# Altium schematic sheet switch_vn9e30f.SchDoc
size A
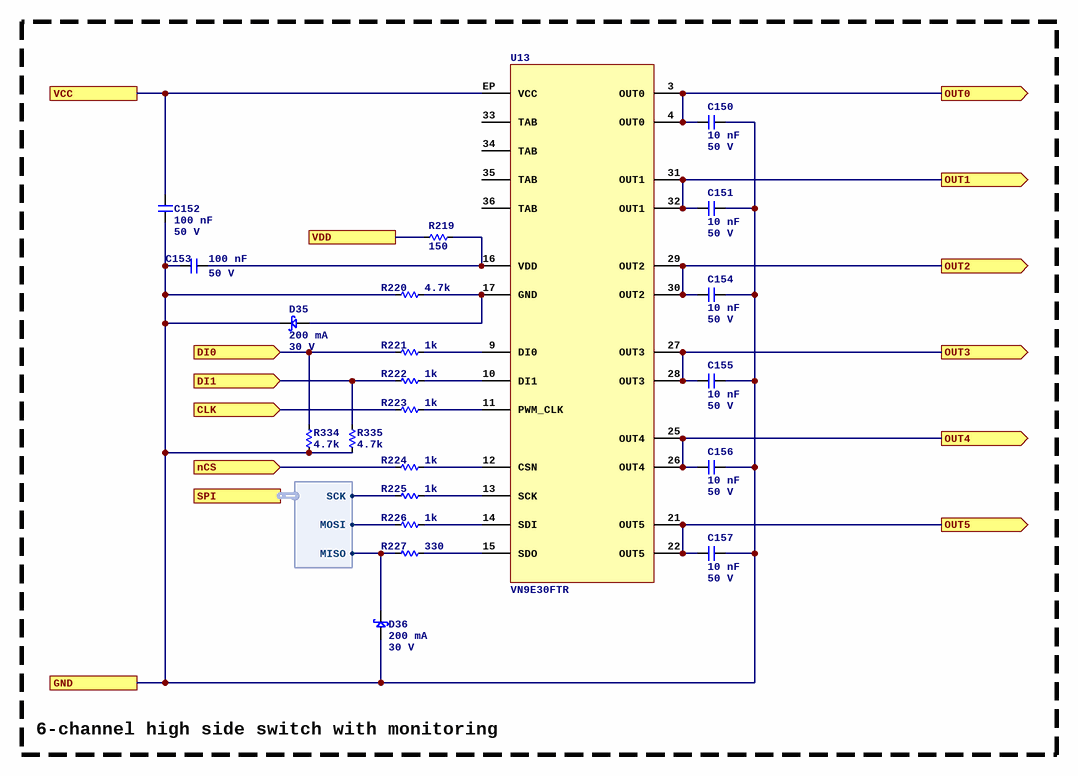
[diagram p0: switch_vn9e30f.SchDoc]

## Parts
C150  Capacitance: 10 nF  Voltage Rating: 50 V  [C0402]  (hidden comment: CL05B103KB5NNNC)
C151  Capacitance: 10 nF  Voltage Rating: 50 V  [C0402]  (hidden comment: CL05B103KB5NNNC)
C152  Capacitance: 100 nF  Voltage Rating: 50 V  [C0402]  (hidden comment: CL05B104KB54PNC)
C153  Capacitance: 100 nF  Voltage Rating: 50 V  [C0402]  (hidden comment: CL05B104KB54PNC)
C154  Capacitance: 10 nF  Voltage Rating: 50 V  [C0402]  (hidden comment: CL05B103KB5NNNC)
C155  Capacitance: 10 nF  Voltage Rating: 50 V  [C0402]  (hidden comment: CL05B103KB5NNNC)
C156  Capacitance: 10 nF  Voltage Rating: 50 V  [C0402]  (hidden comment: CL05B103KB5NNNC)
C157  Capacitance: 10 nF  Voltage Rating: 50 V  [C0402]  (hidden comment: CL05B103KB5NNNC)
D35  Current: 200 mA  Vr: 30 V  [SOD523]  (hidden comment: BAT54XV2T1G)
D36  Current: 200 mA  Vr: 30 V  [SOD523]  (hidden comment: BAT54XV2T1G)
R219  value 150  [R0402]  (hidden comment: 0402WGF1500TCE)
R220  value 4.7k  [R0402]  (hidden comment: 0402WGF4701TCE)
R221  value 1k  [R0402]  (hidden comment: 0402WGF1001TCE)
R222  value 1k  [R0402]  (hidden comment: 0402WGF1001TCE)
R223  value 1k  [R0402]  (hidden comment: 0402WGF1001TCE)
R224  value 1k  [R0402]  (hidden comment: 0402WGF1001TCE)
R225  value 1k  [R0402]  (hidden comment: 0402WGF1001TCE)
R226  value 1k  [R0402]  (hidden comment: 0402WGF1001TCE)
R227  value 330  [R0402]  (hidden comment: 0402WGF3300TCE)
R334  value 4.7k  [R0402]  (hidden comment: 0402WGF4701TCE)
R335  value 4.7k  [R0402]  (hidden comment: 0402WGF4701TCE)
U13  VN9E30FTR  [ST_ECOPACK_QFN50P600X600X90-32N]

## Blocks framed on the sheet
6-channel high side switch with monitoring: C150-C157 D35 D36 R219-R227 R334 R335 U13

## Ports
CLK (in), DI0 (in), DI1 (in), GND, nCS (in), OUT0 (out), OUT1 (out), OUT2 (out), OUT3 (out), OUT4 (out), OUT5 (out), SPI (harness SPI), VCC, VDD

## Harnesses
SPI: MISO, MOSI, SCK

## Nets
CLK: R223.2 ; port CLK
DI0: R221.2 R334.1 ; port DI0
DI1: R222.2 R335.1 ; port DI1
GND: C150.2 C151.2 C152.2 C153.2 C154.2 C155.2 C156.2 C157.2 D35.2 D36.1 R220.2 R334.2 R335.2 ; port GND
nCS: R224.2 ; port nCS
OUT0: C150.1 U13.3(OUT0) U13.4(OUT0) ; port OUT0
OUT1: C151.1 U13.31(OUT1) U13.32(OUT1) ; port OUT1
OUT2: C154.1 U13.29(OUT2) U13.30(OUT2) ; port OUT2
OUT3: C155.1 U13.27(OUT3) U13.28(OUT3) ; port OUT3
OUT4: C156.1 U13.25(OUT4) U13.26(OUT4) ; port OUT4
OUT5: C157.1 U13.21(OUT5) U13.22(OUT5) ; port OUT5
VCC: C152.1 U13.EP(VCC) ; port VCC
VDD: R219.1 ; port VDD
NetC153_1: C153.1 R219.2 U13.16(VDD)
NetD35_1: D35.1 R220.1 U13.17(GND)
NetD36_2: D36.2 R227.1 ; port SPI.MISO
NetR221_1: R221.1 U13.9(DI0)
NetR222_1: R222.1 U13.10(DI1)
NetR223_1: R223.1 U13.11(PWM_CLK)
NetR224_1: R224.1 U13.12(CSN)
NetR225_1: R225.1 U13.13(SCK)
NetR225_2: R225.2 ; port SPI.SCK
NetR226_1: R226.1 U13.14(SDI)
NetR226_2: R226.2 ; port SPI.MOSI
NetR227_2: R227.2 U13.15(SDO)

Not connected (* = marked no-connect by the designer): U13 33(TAB) 34(TAB) 35(TAB) 36(TAB)

## Library data of the parts
C150 C151 C154-C157 = CL05B103KB5NNNC: Manufacturer: Samsung Electro-Mechanics; Dielectric: X7R; ComponentLink1URL: https://wmsc.lcsc.com/wmsc/upload/file/pdf/v2/lcsc/2304140030_Samsung-Electro-Mechanics-CL05B103KB5NNNC_C15195.pdf; ComponentLink1Description: Datasheet; Manufacturer Part Number: CL05B103KB5NNNC; Package: 0402; Supplier 2: LCSC; Supplier Part Number 2: C15195
C152 C153 = CL05B104KB54PNC: Manufacturer: Samsung Electro-Mechanics; Dielectric: X7R; ComponentLink1URL: https://wmsc.lcsc.com/wmsc/upload/file/pdf/v2/lcsc/2304140030_Samsung-Electro-Mechanics-CL05B104KB54PNC_C307331.pdf; ComponentLink1Description: Datasheet; Manufacturer Part Number: CL05B104KB54PNC; Package: 0402; Supplier 2: LCSC; Supplier Part Number 2: C307331
D35 D36 = BAT54XV2T1G: ON Semi BAT54XV2T1G; SMT Schottky Diode; 30V 200mA; 5ns; 2-Pin SOD-523; Manufacturer: onsemi; Supplier 1: DigiKey; Supplier Part Number 1: BAT54XV2T1GOSCT-ND; Manufacturer Part Number: BAT54XV2T1G; Supplier 2: LCSC; Supplier Part Number 2: C81572; ComponentLink1Description: Datasheet; ComponentLink1URL: https://www.onsemi.com/pdf/datasheet/bat54xv2t1-d.pdf; Diode Type: Schottky; Supplier 3: Mouser; Supplier Part Number 3: 863-BAT54XV2T1G
R219 = 0402WGF1500TCE: Manufacturer: UNI-ROYAL(Uniroyal Elec); Tolerance: 1%; Temperature Coefficient: ±100ppm/?; Power Rating (mW): 62.5; ComponentLink1Description: Datasheet; ComponentLink1URL: https://wmsc.lcsc.com/wmsc/upload/file/pdf/v2/lcsc/2205311900_UNI-ROYAL-Uniroyal-Elec-0402WGF1500TCE_C25082.pdf; Manufacturer Part Number: 0402WGF1500TCE; Package: 0402; Supplier 2: LCSC; Supplier Part Number 2: C25082
R220 R334 R335 = 0402WGF4701TCE: Manufacturer: UNI-ROYAL(Uniroyal Elec); Tolerance: 1%; Temperature Coefficient: ±100ppm/?; Power Rating (mW): 62.5; ComponentLink1Description: Datasheet; ComponentLink1URL: https://wmsc.lcsc.com/wmsc/upload/file/pdf/v2/lcsc/2206010045_UNI-ROYAL-Uniroyal-Elec-0402WGF4701TCE_C25900.pdf; Manufacturer Part Number: 0402WGF4701TCE; Package: 0402; Supplier 2: LCSC; Supplier Part Number 2: C25900
R221-R226 = 0402WGF1001TCE: Manufacturer: UNI-ROYAL(Uniroyal Elec); Tolerance: 1%; Temperature Coefficient: ±100ppm/?; Power Rating (mW): 62.5; ComponentLink1Description: Datasheet; ComponentLink1URL: https://wmsc.lcsc.com/wmsc/upload/file/pdf/v2/lcsc/2206010216_UNI-ROYAL-Uniroyal-Elec-0402WGF1001TCE_C11702.pdf; Manufacturer Part Number: 0402WGF1001TCE; Package: 0402; Supplier 2: LCSC; Supplier Part Number 2: C11702
R227 = 0402WGF3300TCE: Manufacturer: UNI-ROYAL(Uniroyal Elec); Tolerance: 1%; Temperature Coefficient: ±100ppm/?; Power Rating (mW): 62.5; ComponentLink1Description: Datasheet; ComponentLink1URL: https://wmsc.lcsc.com/wmsc/upload/file/pdf/v2/lcsc/2205311900_UNI-ROYAL-Uniroyal-Elec-0402WGF3300TCE_C25104.pdf; Manufacturer Part Number: 0402WGF3300TCE; Package: 0402; Supplier 2: LCSC; Supplier Part Number 2: C25104
U13 = VN9E30FTR: Power Switch/Driver 1:6 N-Channel 35A 32-QFN (6x6); Manufacturer: STMicroelectronics; Supplier 1: DigiKey; Supplier Part Number 1: 497-VN9E30FTRCT-ND; Manufacturer Part Number: VN9E30FTR; ComponentLink1Description: Datasheet; ComponentLink1URL: https://www.st.com/resource/en/datasheet/vn9e30f.pdf; Supplier 2: LCSC; Supplier Part Number 2: C29447350; Supplier 3: Mouser; Supplier Part Number 3: 511-VN9E30FTR